# EAGLE design Pendent (EAGLE 7.4.0)
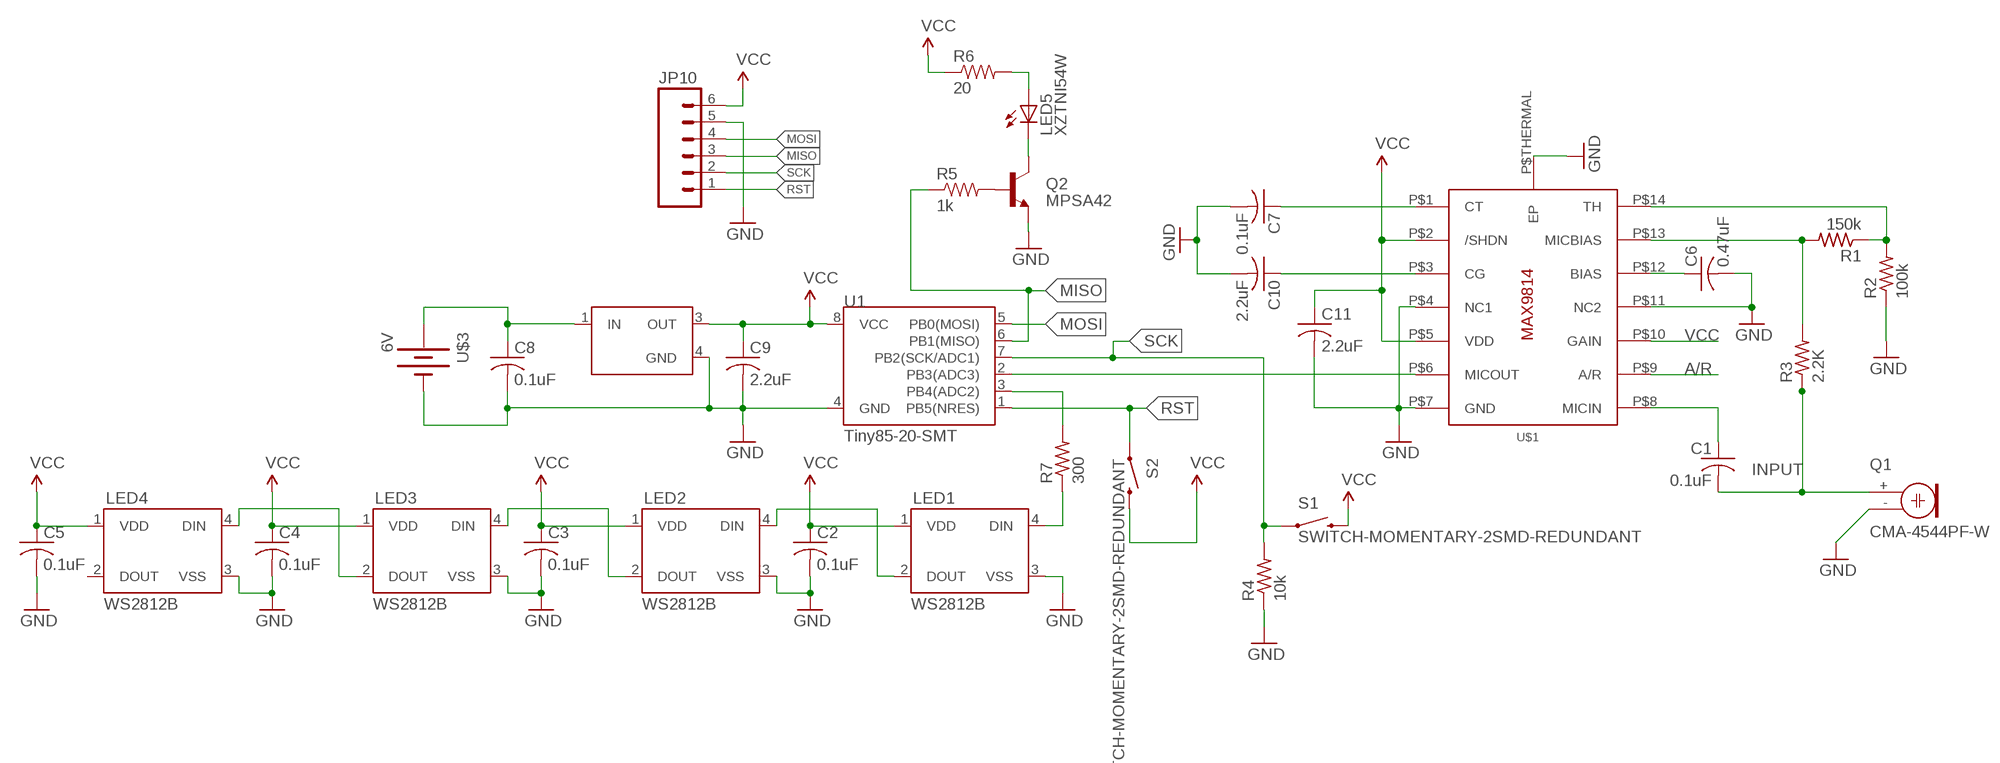
[diagram p0: schematic, sheet 1]

## Parts
C1  0.1uF  C-USC0805K  [C0805K]
C2  0.1uF  C-USC0805K  [C0805K]
C3  0.1uF  C-USC0805K  [C0805K]
C4  0.1uF  C-USC0805K  [C0805K]
C5  0.1uF  C-USC0805K  [C0805K]
C6  0.47uF  C-USC0805K  [C0805K]
C7  0.1uF  C-USC0805K  [C0805K]
C8  0.1uF  C-USC0805K  [C0805K]
C9  2.2uF  C-USC0805K  [C0805K]
C10  2.2uF  C-USC0805K  [C0805K]
C11  2.2uF  C-USC0805K  [C0805K]
JP10  M06SIP  [1X06]
LED1  WS2812B  [WS2812B]
LED2  WS2812B  [WS2812B]
LED3  WS2812B  [WS2812B]
LED4  WS2812B  [WS2812B]
LED5  XZTNI54W  LEDCHIP-LED0805  [CHIP-LED0805]
Q1  CMA-4544PF-W  ELECTRET  [9.7ELECTRET]
Q2  MPSA42  TRANSISTOR_NPNMPSA42  [SOT23-3]
R1  150k  R-US_R0805  [R0805]
R2  100k  R-US_R0805  [R0805]
R3  2.2K  R-US_R0805  [R0805]
R4  10k  R-US_M0805  [M0805]
R5  1k  RESISTOR0805-RES  [0805]
R6  20  RESISTOR0805-RES  [0805]
R7  300  R-US_M0805  [M0805]
S1  SWITCH-MOMENTARY-2SMD-REDUNDANT  [TACTILE-SWITCH-SMD]
S2  SWITCH-MOMENTARY-2SMD-REDUNDANT  [TACTILE-SWITCH-SMD]
U1  Tiny85-20-SMT  ATTINY45TINY85-20-SMT  [SO08-EIAJ]
U2  LF50ABDT-TR  [DPAK]
U$1  MAX9814TDFN14  [TDFN14_3X3MM]
U$3  6V  BATTERY20SMD  [BATTCON_20MM]

## Nets
A/R: U$1.P$9(A/R)
GND: C2.2 C3.2 C4.2 C5.2 C6.2 C7.2 C8.2 C9.2 C10.2 C11.2 JP10.5 LED1.3(VSS) LED2.3(VSS) LED3.3(VSS) LED4.3(VSS) Q1.- Q2.2(E) R2.1 R4.1 U1.4(GND) U2.4(GND) U$1.P$4(NC1) U$1.P$7(GND) U$1.P$11(NC2) U$1.P$THERMAL(EP) U$3.2(-)
INPUT: C1.2 Q1.+ R3.1
MISO: JP10.3 R5.1 U1.6(PB1(MISO))
MOSI: JP10.4 U1.5(PB0(MOSI))
N$2: LED2.2(DOUT) LED3.4(DIN)
N$3: LED3.2(DOUT) LED4.4(DIN)
N$4: R7.2 U1.3(PB4(ADC2))
N$5: C1.1 U$1.P$8(MICIN)
N$6: C8.1 U2.1(IN) U$3.1(+)
N$7: C6.1 U$1.P$12(BIAS)
N$8: C7.1 U$1.P$1(CT)
N$9: C10.1 U$1.P$3(CG)
N$10: R1.1 R2.2 U$1.P$14(TH)
N$11: R1.2 R3.2 U$1.P$13(MICBIAS)
N$13: Q2.1(B) R5.2
N$14: U1.2(PB3(ADC3)) U$1.P$6(MICOUT)
N$15: LED5.C Q2.3(C)
N$16: LED5.A R6.2
N$18: LED1.4(DIN) R7.1
N$22: LED1.2(DOUT) LED2.4(DIN)
RST: JP10.1 S2.1 S2.2 U1.1(PB5(NRES))
SCK: JP10.2 R4.2 S1.1 S1.2 U1.7(PB2(SCK/ADC1))
VCC: C2.1 C3.1 C4.1 C5.1 C9.1 C11.1 JP10.6 LED1.1(VDD) LED2.1(VDD) LED3.1(VDD) LED4.1(VDD) R6.1 S1.3 S1.4 S2.3 S2.4 U1.8(VCC) U2.3(OUT) U$1.P$2(/SHDN) U$1.P$5(VDD) U$1.P$10(GAIN)
Unconnected: LED4.2(DOUT)

## Library data of the parts
C1-C11 = adafruit:C-US: CAPACITOR, American symbol
JP10 = SparkFun-Connectors:M06: Header 6 Standard 6-pin 0.1" header. Use with straight break away headers (SKU : PRT-00116), right angle break away headers (PRT-00553), swiss pins (PRT-00743), machine pins (PRT-00117), and female headers (PRT-00115). Molex polarized connector foot print use with SKU : PRT-08094 with associated crimp pins and housings. NOTES ON THE VARIANTS LOCK and LOCK_LONGPADS... This footprint was designed to help hold the alignment of a through-hole component (i.e. 6-pin header) while soldering it into place. You may notice that each hole has been shifted either up or down by 0.005 of an inch from it's more standard position (which is a perfectly straight line). This slight alteration caused the pins (the squares in the middle) to touch the edges of the holes. Because they are alternating, it causes a "brace" to hold the component in place. 0.005 has proven to be the perfect amount of "off-center" position when using our standard breakaway headers. Although looks a little odd when you look at the bare footprint, once you have a header in there, the alteration is very hard to notice. Also, if you push a header all the way into place, it is covered up entirely on the bottom side. This idea of altering the position of holes to aid alignment will be further integrated into the Sparkfun Library for other footprints. It can help hold any component with 3 or more connection pins.
LED1-LED4 = SparkFun-LED:WS2812B: WS2812B - Intelligent control LED integrated light source Technical Specifications: Power Supply Voltage (VDD): 3.5 to 5.3 V Input Voltage (VI): -0.5 to VDD+0.5 V Operating Junction Temperature (Topt): -25°C to +80°C Storage Temperature Range (Tstg): -55°C to +150°C; PROD_ID: DIO-12503
LED5 = adafruit:LED: LED OSRAM: - CHIPLED LG R971, LG N971, LY N971, LG Q971, LY Q971, LO R971, LY R971 LH N974, LH R974 LS Q976, LO Q976, LY Q976 LO Q996 - Hyper CHIPLED LW Q18S LB Q993, LB Q99A, LB R99A - SideLED LS A670, LO A670, LY A670, LG A670, LP A670 LB A673, LV A673, LT A673, LW A673 LH A674 LY A675 LS A676, LA A676, LO A676, LY A676, LW A676 LS A679, LY A679, LG A679 - Hyper Micro SIDELED® LS Y876, LA Y876, LO Y876, LY Y876 LT Y87S - SmartLED LW L88C, LW L88S LB L89C, LB L89S, LG L890 LS L89K, LO L89K, LY L89K LS L896, LA L896, LO L896, LY L896 - TOPLED LS T670, LO T670, LY T670, LG T670, LP T670 LSG T670, LSP T670, LSY T670, LOP T670, LYG T670 LG T671, LOG T671, LSG T671 LB T673, LV T673, LT T673, LW T673 LH T674 LS T676, LA T676, LO T676, LY T676, LB T676, LH T676, LSB T676, LW T676 LB T67C, LV T67C, LT T67C, LS T67K, LO T67K, LY T67K, LW E67C LS E67B, LA E67B, LO E67B, LY E67B, LB E67C, LV E67C, LT E67C LW T67C LS T679, LY T679, LG T679 LS T770, LO T770, LY T770, LG T770, LP T770 LB T773, LV T773, LT T773, LW T773 LH T774 LS E675, LA E675, LY E675, LS T675 LS T776, LA T776, LO T776, LY T776, LB T776 LHGB T686 LT T68C, LB T68C - Hyper Mini TOPLED® LB M676 - Mini TOPLED Santana® LG M470 LS M47K, LO M47K, LY M47K Source: http://www.osram.convergy.de/
Q1 = adafruit:ELECTRET: Electret microphone Thru hole 2.54mm spacing with 9.7mm diameter
Q2 = SparkFun-DiscreteSemi:TRANSISTOR_NPN: Generic NPN BJT MMBT2222A - TRANS-08049 (SOT-23, 1A 40V) MPSA42 - TRANS-09116 (SOT-23, 500mA 300V) MMBT5088LT1G - TRANS-11160 (SOT-23, 50 mA 30V) BC547 - COM-08928 <http://www.sparkfun.com/products/8928> (TO-92 45V 100mA) (1.Collector 2.Base 3.Emitter) 2N3904 - COM-00521 <http://www.sparkfun.com/products/521> (TO-92 40V 200mA) (1.Emitter 2.Base 3.Collector) P2N2222A - COM-12852 <http://www.sparkfun.com/products/12852> (TO-92 40V 600mA) (1.Collector 2.Base 3.Emitter); PROD_ID: TRANS-09116
R1-R4 R7 = adafruit:R-US_: RESISTOR, American symbol
R5 R6 = SparkFun-Passives:RESISTOR: Resistor Basic schematic elements and footprints for 0603, 1206, and PTH resistors.
S1 S2 = SparkFun-Electromechanical:SWITCH-MOMENTARY-2: Various NO switches- pushbuttons, reed, etc; PROD_ID: SWCH-08247
U1 = SparkFun-DigitalIC:ATTINY45: Atmel 8-pin 2/4/8kB flash uC; PROD_ID: IC-09092
U2 = BAG:LF50ABDT-TR: STMicroelectronics: LF50ABDT-TR DigiKey: 497-8344-1-ND Description The LFXX is a very low drop regulator available in TO-220, TO-220FP, DPAK and PPAK packages and in a wide range of output voltages. The low drop voltage (0.45 V) and low quiescent current make it particularly suitable for low-noise, lowpower applications and especially in batterypowered systems. In the 5 pin configuration (PPAK) a shutdown logic control function is available (pin 2, TTL compatible). This means that when the device is used as a local regulator, a part of the board can be put in standby, decreasing the total power consumption. In the three terminal configuration, the device has the same electrical performance, but it is fixed in ON state. It requires a capacitor of only 2.2 µF for stability, saving board space and costs. The LFXX is available as automotive grade in DPAK and PPAK packages, for the options of output voltages whose commercial part numbers are shown in the order codes. These devices are qualified according to the specification AEC-Q100 of the automotive market, in the temperature range - 40 °C to 125 °C, and the statistical tests PAT, SYL, SBL are performed. http://www.st.com/web/en/resource/technical/document/datasheet/CD00000546.pdf
U$1 = adafruit:MAX9814
U$3 = SparkFun-Electromechanical:BATTERY: Battery Holders Various common sizes : AA, AAA, 18650 (PRT-12895), 20mm coin cell and 12mm coin cell. 20MM_4LEGS, BATT-10373

## Board
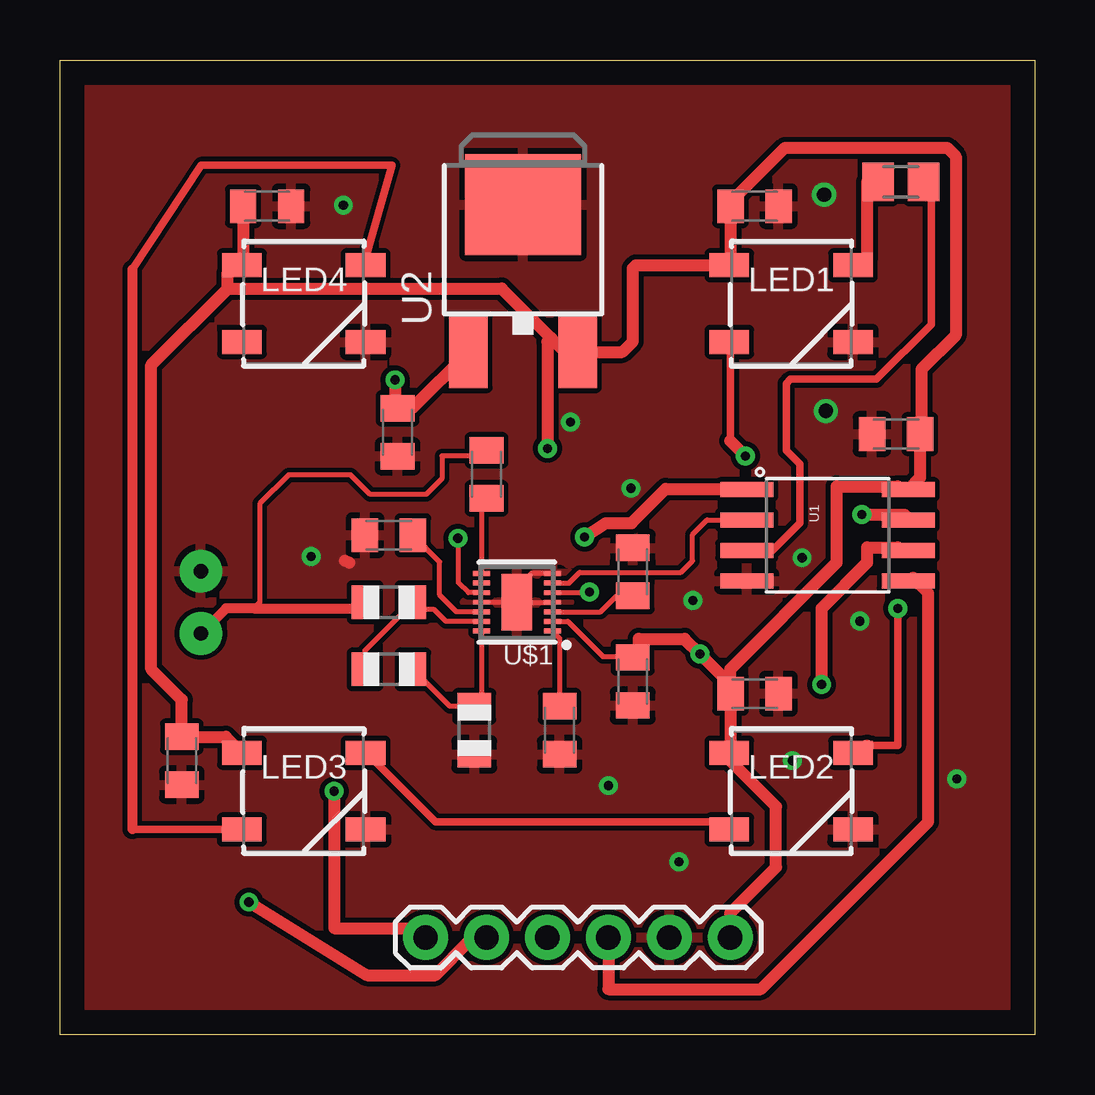
[diagram p1: board, top side]
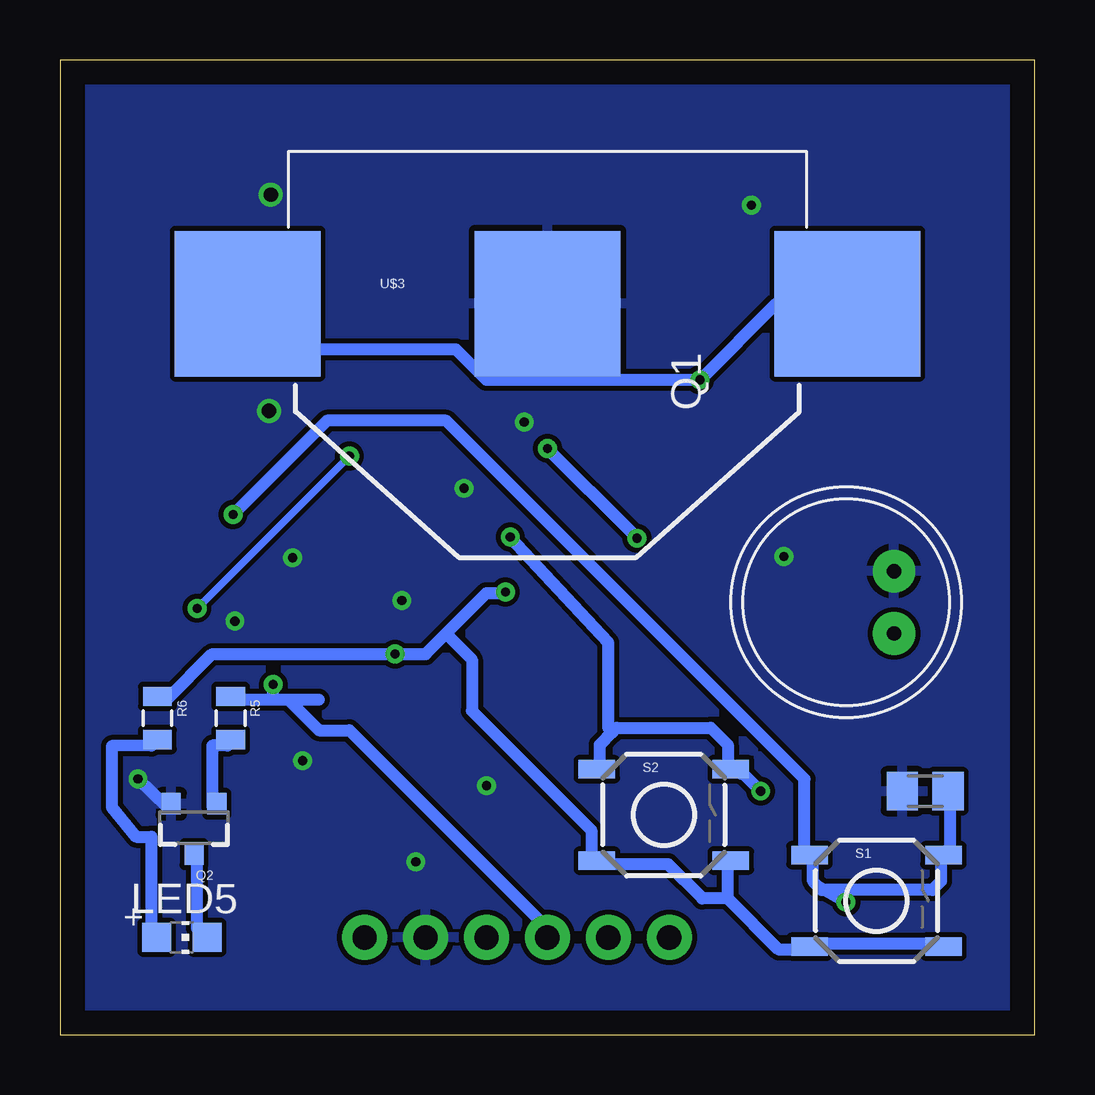
[diagram p2: board, bottom side, seen from below]

Size 40.64 x 40.64 mm. Coordinates in mm from the lower left corner, seen from the top.
Outline: 0,0 0,40.64 40.64,40.64 40.64,0 0,0
Copper layers (1*16): Top 0.035mm / dielectric 1.5mm / Bottom 0.035mm
Design rules "default *": minimum track width 20mil, minimum drill 15mil, track to track 8mil, track to pad 8mil, pad to pad 8mil, via to via 8mil, smd to smd 8mil, copper to edge 40mil, drill to drill 8mil, minimum pad ring 10mil, minimum via ring 8mil, stop-mask expansion 4mil, vias tented up to drill 0mil, thermal gap 10mil

### Footprints (pad centres in the part's own frame; a part is rotated, then mirrored left to right if it is on the bottom)
C0805K = smd 1.1 x 1.4: 1 -1,0; 2 1,0
1X06 = drill 1.016 pad 1.88: 1 0,0; 2 2.54,0; 3 5.08,0; 4 7.62,0; 5 10.16,0; 6 12.7,0
WS2812B = smd 1.651 x 1: 1 -2.577,1.6; 2 -2.577,-1.6; 3 2.577,-1.6; 4 2.577,1.6
CHIP-LED0805 = smd 1.2 x 1.2: A 0,-1.05; C 0,1.05
9.7ELECTRET = drill 0.6 pad 1.778: + 1.3,2; - -1.3,2
SOT23-3 = smd 0.8 x 0.9: 1 -0.95,-1; 2 0.95,-1; 3 0,1.1
R0805 = smd 1.1 x 1.4: 1 -1,0; 2 1,0
M0805 = smd 1.3 x 1.6: 1 -0.95,0; 2 0.95,0
0805 = smd 0.8 x 1.2: 1 -0.9,0; 2 0.9,0
TACTILE-SWITCH-SMD = smd 1.524 x 0.762: 1 -2.794,1.905; 2 2.794,1.905; 3 -2.794,-1.905; 4 2.794,-1.905
SO08-EIAJ = smd 0.61 x 2.21: 1 -1.905,-3.378; 2 -0.635,-3.378; 3 0.635,-3.378; 4 1.905,-3.378; 5 1.905,3.353; 6 0.635,3.353; 7 -0.635,3.353; 8 -1.905,3.353
DPAK = smd 1.6 x 3: 1 -2.28,-4.04; 3 2.28,-4.04 | smd 4.826 x 4.191: 4 0,2.096
TDFN14_3X3MM = smd 0.7 x 0.2: P$1 -1.475,1.2; P$2 -1.475,0.8; P$3 -1.475,0.4; P$4 -1.475,0; P$5 -1.475,-0.4; P$6 -1.475,-0.8; P$7 -1.475,-1.2; P$8 1.475,-1.2; P$9 1.475,-0.8; P$10 1.475,-0.4; P$11 1.475,0; P$12 1.475,0.4; P$13 1.475,0.8; P$14 1.475,1.2 | smd 1.27 x 2.35: P$THERMAL 0,0
BATTCON_20MM = smd 6.07 x 6.07: 1 -12.5,0; 2 0,0; 3 12.5,0

### Placement (x,y rotation side)
C1  17.78,23.37 90 top
C2  28.96,34.54 0 top
C3  28.96,14.22 0 top
C4  5.08,11.43 270 top
C5  8.64,34.54 0 top
C6  13.72,20.83 180 top
C7  20.83,12.7 270 top
C8  14.07,25.12 270 top
C9  34.85,25.04 180 top
C10  23.88,19.3 90 top
C11  23.88,14.73 270 top
JP10  15.24,4.06 0 top
LED1  30.48,30.48 0 top
LED2  30.48,10.16 0 top
LED3  10.16,10.16 0 top
LED4  10.16,30.48 0 top
LED5  35.56,4.06 270 bottom
Q1  7.87,18.03 270 bottom
Q2  35.05,8.64 180 bottom
R1  13.72,15.24 180 top
R2  17.27,12.7 90 top
R3  13.72,18.03 0 top
R4  4.57,10.16 0 bottom
R5  33.53,13.21 270 bottom
R6  36.58,13.21 270 bottom
R7  35.05,35.56 0 top
S1  6.6,5.59 0 bottom
S2  15.47,9.17 0 bottom
U1  32,20.83 270 top
U2  19.3,32.51 0 top
U$1  19.05,18.03 180 top
U$3  20.32,30.48 0 bottom

### Tracks (layer width: path | path; a pad name or v marks a point on that pad's centre or on a via)
GND  (via drill 0.38, 0.6)
  Top 0.203: U$1.P$THERMAL U$1.P$11 | U$1.P$THERMAL U$1.P$4 | U$1.P$7 19.64,19.23 19.25,18.85 19.25,18.24 U$1.P$THERMAL
  Top 0.508: 12.06,19.68 11.88,19.76
  Bottom 0.508: v37.39,10.67 36.2,9.53 Q2.2
  other vias: 22.86,10.39 25.81,7.21 30.53,11.43 26.39,18.11 23.8,22.78 21.29,25.55 33.35,17.25 10.46,19.94 11.81,34.59 30.94,19.89 31.93,26.01 31.85,35.03
  pour Top: -1.02,41.66 41.66,41.66 41.66,-1.02 -1.02,-1.02
  pour Bottom: -0.51,41.15 41.15,41.15 41.15,-0.51 -0.51,-0.51
INPUT
  Top 0.203: 17.78,24.13 15.93,24.13 15.93,23.19 15.27,22.53 12.93,22.53 12.12,23.34 9.53,23.34 8.33,22.15 8.33,18.03 8.08,17.78
  Top 0.406: 12.7,17.78 8.08,17.78 6.92,17.78 Q1.+
  Top 0.508: 12.7,17.78 R3.1 | 17.78,24.13 C1.2
MISO  (via drill 0.38)
  Top 0.508: v31.75,14.61 31.75,17.78 33.66,19.68 33.66,20.32 34.92,20.32 U1.6
  Bottom 0.508: 29.84,13.97 31.11,13.97 | 31.11,13.97 31.75,13.97 | 31.75,13.97 33.02,13.97 R5.1 | 31.75,13.97 v31.75,14.61 | 31.11,13.97 29.84,12.7 28.57,12.7 20.32,4.45 JP10.3
MOSI
  Top 0.508: JP10.4 22.86,1.91 29.21,1.91 36.2,8.89 36.2,18.41 35.56,19.05 U1.5
N$2
  Top 0.305: 12.8,11.73 15.65,8.89 27.74,8.89 LED2.2
  Top 0.508: 12.8,11.73 LED3.4
N$3
  Top 0.305: 3.02,8.57 7.46,8.57 | 3.02,31.91 5.89,36.25 13.84,36.25 12.7,32.23
  Top 0.406: 3.02,31.91 3.02,8.57
  Top 0.508: 7.46,8.57 LED3.2 | 12.7,32.23 LED4.4
N$4
  Top 0.305: U1.3 29.69,20.19 30.84,21.34 30.84,23.8 30.28,24.36 30.28,27.15 30.45,27.33 34.04,27.33 36.32,29.62 36.32,35.24 R7.2
N$5
  Top 0.203: C1.1 17.57,22.16 U$1.P$8
N$6  (via drill 0.38)
  Top 0.508: U2.1 14.67,26.12 C8.1 13.97,26.67 v13.97,27.3
  Bottom 0.508: 10.79,30.48 v13.97,27.3 22.86,27.3 24.13,28.57 30.48,28.57 | 30.48,28.57 31.11,28.57 | 30.48,28.57 32.38,30.48 U$3.1
N$7
  Top 0.203: U$1.P$12 16.53,17.63 15.82,18.34 15.82,19.72 C6.1
N$8
  Top 0.203: U$1.P$1 20.83,16.53 C7.1
N$9
  Top 0.203: U$1.P$3 22.54,17.63 23.19,18.29 23.86,18.29 C10.1
N$10
  Top 0.203: U$1.P$14 17.57,14 R2.2 16.26,13.7 R1.1
N$11
  Top 0.203: R1.2 12.72,16.03 R3.2 15.02,17.73 15.6,17.73 16.09,17.23 U$1.P$13
N$13
  Bottom 0.508: Q2.1 34.29,9.53 34.29,12.06 33.66,12.06 R5.2
N$14
  Top 0.203: U$1.P$6 21.22,18.83 21.67,19.28 25.88,19.28 26.36,19.76 26.36,20.85 26.98,21.46 U1.2
N$15
  Bottom 0.508: Q2.3 34.92,7.62 34.92,4.45 LED5.C
N$16
  Bottom 0.508: LED5.A 36.83,4.45 36.83,8.26 37.47,8.26 38.48,9.5 38.48,12.04 36.83,12.06 R6.2
N$18
  Top 0.508: R7.1 33.66,35.56 33.66,32.38 LED1.4
N$22  (via drill 0.38)
  Top 0.305: 33.66,12.06 34.92,12.06 v34.92,17.78 | 27.94,28.57 27.94,24.77
  Top 0.508: 27.94,24.77 v28.57,24.13 | 27.94,28.57 LED1.2 | 33.66,12.06 LED2.4
  Bottom 0.305: v28.57,24.13 v34.92,17.78
RST  (via drill 0.38)
  Top 0.508: v21.87,20.75 22.76,21.34 23.82,21.34 25.25,22.76 28.45,22.76 U1.1 | v11.43,10.16 11.43,4.45 15.24,4.45 JP10.1
  Bottom 0.508: 17.6,12.62 18.14,12.09 18.14,11.38 S2.1 | 17.6,12.62 17.42,12.8 13.51,12.8 12.8,12.09 12.8,11.38 S2.2 12.06,10.79 v11.43,10.16 | v21.87,20.75 17.78,16.36 17.78,12.8 17.6,12.62
SCK  (via drill 0.38)
  Top 0.508: v33.43,21.69 35.2,21.69 U1.7 | v7.87,5.54 12.8,2.49 15.65,2.49 17.07,3.91 17.78,3.91 JP10.2
  Bottom 0.508: R4.2 3.56,9.96 3.56,7.82 S1.2 3.91,7.47 3.91,6.4 4.27,6.04 8.89,6.04 9.07,6.22 | 9.07,6.22 9.25,6.4 9.25,7.47 S1.1 9.6,7.82 9.6,10.67 24.54,25.6 29.52,25.6 v33.43,21.69 | v7.87,5.54 9.07,6.22
VCC  (via drill 0.38)
  Top 0.203: U$1.P$2 21.17,17.23 22.63,15.77 23.84,15.77 C11.1 | U$1.P$5 22.04,18.43 v22.07,18.47 | U$1.P$10 17.02,18.43 16.61,18.85 16.61,20.68 v16.59,20.7
  Top 0.508: LED3.1 6.91,12.43 C4.1 5.08,13.97 3.81,15.24 3.81,27.94 6.99,31.11 | C5.1 7.64,32.13 LED4.1 6.99,31.75 6.99,31.11 | LED1.1 27.96,32.13 C2.1 28.09,34.85 30.23,36.98 36.98,36.98 37.34,36.63 37.34,29.16 35.92,27.74 35.92,25.25 C9.1 35.85,23.23 U1.8 34.92,22.86 32.38,22.86 32.38,19.68 27.94,15.24 27.94,14.61 | LED1.1 24,32.08 23.88,31.95 23.88,28.91 23.44,28.47 U2.3 20.95,28.57 20.48,29.05 | LED1.1 | 20.48,29.05 18.41,31.11 6.99,31.11 | 27.94,14.61 v26.67,15.88 26.04,16.51 24.13,16.51 24.13,15.88 C11.1 | JP10.6 27.94,5.08 29.84,6.99 29.84,9.53 27.94,11.43 LED2.1 27.96,11.81 C3.1 27.94,14.61 | v20.32,24.45 20.32,28.89 20.48,29.05
  Bottom 0.508: 24.55,16.73 25.4,15.88 v26.67,15.88 34.29,15.88 36.2,13.97 R6.1 | 24.55,16.73 22.86,18.41 22.23,18.41 v22.07,18.47 | S1.4 3.81,3.81 8.89,3.81 S1.3 9.6,3.56 10.67,3.56 12.8,5.69 | v20.32,24.45 16.83,20.95 v16.59,20.7 | 12.8,5.69 12.8,7.11 S2.4 | 12.8,5.69 13.87,5.69 15.29,7.11 18.14,7.11 S2.3 18.49,7.47 18.49,8.53 23.47,13.51 23.47,15.65 24.55,16.73

### Text on the board
tValues: RST | GND | VCC
bValues: RST | VCC | GND
bDocu: RESET